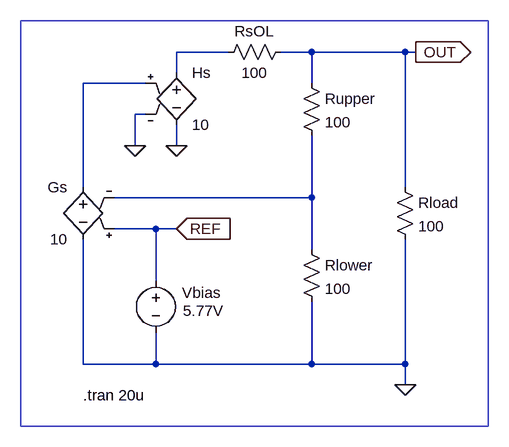
[diagram p0: schematic Switch-Mode_Power_Supplies_-_Basso-_Figure_1-5.asc]
Switch-Mode_Power_Supplies_-_Basso-_Figure_1-5.asc, the LTspice schematic file:
Version 4
SHEET 1 880 852
WIRE -528 -48 -608 -48
WIRE -400 -48 -448 -48
WIRE -256 -48 -400 -48
WIRE -240 -48 -256 -48
WIRE -608 -16 -608 -48
WIRE -656 0 -752 0
WIRE -400 0 -400 -48
WIRE -656 48 -672 48
WIRE -672 96 -672 48
WIRE -608 96 -608 64
WIRE -752 160 -752 0
WIRE -256 160 -256 -48
WIRE -400 176 -400 80
WIRE -400 176 -704 176
WIRE -640 224 -704 224
WIRE -608 224 -640 224
WIRE -400 256 -400 176
WIRE -640 304 -640 224
WIRE -752 432 -752 240
WIRE -640 432 -640 384
WIRE -640 432 -752 432
WIRE -400 432 -400 336
WIRE -400 432 -640 432
WIRE -256 432 -256 240
WIRE -256 432 -400 432
WIRE -256 464 -256 432
FLAG -256 464 0
FLAG -240 -48 OUT
IOPIN -240 -48 Out
FLAG -672 96 0
FLAG -608 96 0
FLAG -608 224 REF
IOPIN -608 224 In
SYMBOL voltage -640 288 R0
WINDOW 123 0 0 Left 0
WINDOW 39 0 0 Left 0
WINDOW 0 40 34 Left 0
WINDOW 3 42 62 Left 0
SYMATTR InstName Vbias
SYMATTR Value 5.77V
SYMBOL res -272 144 R0
SYMATTR InstName Rload
SYMATTR Value 100
SYMBOL res -416 -16 R0
SYMATTR InstName Rupper
SYMATTR Value 100
SYMBOL res -416 240 R0
SYMATTR InstName Rlower
SYMATTR Value 100
SYMBOL e2 -752 144 M0
SYMATTR InstName Gs
SYMATTR Value 10
SYMBOL e -608 -32 R0
SYMATTR InstName Hs
SYMATTR Value 10
SYMBOL res -432 -64 R90
WINDOW 0 0 56 VBottom 0
WINDOW 3 32 56 VTop 0
SYMATTR InstName RsOL
SYMATTR Value 100
TEXT -752 480 Left 0 !.tran 20u
RECTANGLE Normal -128 528 -848 -96

The netlist it stands for:
* Switch-Mode_Power_Supplies_-_Basso-_Figure_1-5.asc
Vbias REF 0 5.77V
Rload OUT 0 100
Rupper OUT N003 100
Rlower N003 0 100
E§Gs N002 0 REF N003 10
E§Hs N001 0 N002 0 10
RsOL OUT N001 100
.tran 20u
.backanno
.end